# Altium schematic sheet CapBank_Supercaps.SchDoc
size A; SheetNumber: 4
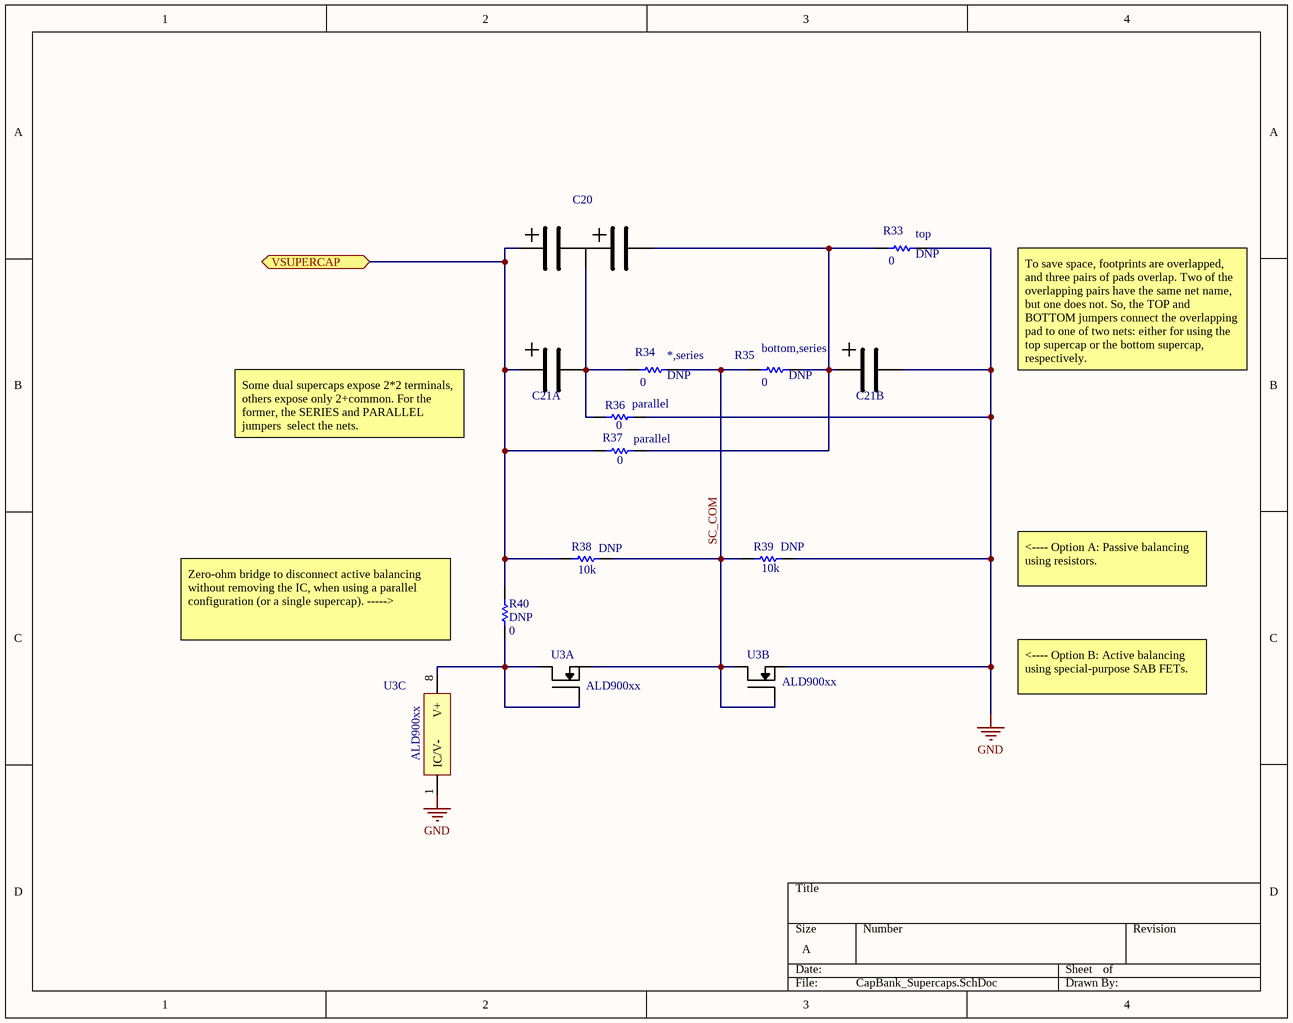
[diagram p0: CapBank_Supercaps.SchDoc]

## Parts
C20  SUPERCAP_DUAL_SERIES  [SUPERCAP_DMT]  (value not drawn)
C21  SUPERCAP_DUAL  [SUPERCAP_DMHA14R]  (value not drawn)  (parts A,B of 2)
R33  value 0  Note: DNP  Config: top  [0603]  (hidden comment: Res)
R34  value 0  Note: DNP  Config: *,series  [0603]  (hidden comment: Res)
R35  value 0  Note: DNP  Config: bottom,series  [0603]  (hidden comment: Res)
R36  value 0  Config: parallel  [0603]  (hidden comment: Res)
R37  value 0  Config: parallel  [0603]  (hidden comment: Res)
R38  value 10k  Note: DNP  [0603]  (hidden comment: Res)
R39  value 10k  Note: DNP  [0603]  (hidden comment: Res)
R40  value 0  Note: DNP  [0603]  (hidden comment: Res)
U3  ALD900xx  [SOIC8]  (parts A,B,C of 3)

## Ports
VSUPERCAP (bidir)

## Nets
GND: C21.4(N1) R33.2 R36.2 R39.2 U3.1(IC/V-) U3.5(SN2)
SC_COM: R34.2 R35.1 R38.2 R39.1 U3.4(SN1) U3.6(DN2) U3.7(GN2)
VSUPERCAP: C20.1(P) C21.1(P2) R37.1 R38.1 R40.1 ; port VSUPERCAP
NetC20_2: C20.2(BAL) C21.2(N2) R34.1 R36.1
NetC20_3: C20.3(N) C21.3(P1) R33.1 R35.2 R37.2
NetR40_2: R40.2 U3.2(GN1) U3.3(DN1) U3.8(V+)

## Notes on the sheet
- To save space, footprints are overlapped, and three pairs of pads overlap. Two of the overlapping pairs have the same net name, but one does not. So, the TOP and BOTTOM jumpers connect the overlapping pad to one of two nets: either for using the top supercap or the bottom supercap, respectively.
- Some dual supercaps expose 2*2 terminals, others expose only 2+common. For the former, the SERIES and PARALLEL jumpers  select the nets.
- Zero-ohm bridge to disconnect active balancing without removing the IC, when using a parallel configuration (or a single supercap). ----->
- <---- Option A: Passive balancing using resistors.
- <---- Option B: Active balancing using special-purpose SAB FETs.

## Library data of the parts
C20 = SUPERCAP_DUAL_SERIES: EDLC Supercap Dual with Balancing Terminal; Manufacturer: Murata Electronics; Manufacturer Part Number: DMT3N4R2U224M3DTA0; Note: OPT; Rating: 4.2/2.1V; Value: 220mF; Digi-Key Part Number: 490-13208-ND; Distributor: Mouser; Distributor Part Number: 81-DMT3N4R2U224M3DT0; Mouser Part Number: 81-DMT3N4R2U224M3DT0
C21 = SUPERCAP_DUAL: EDLC Supercap Dual; Manufacturer: Murata Electronics; Manufacturer Part Number: DMHA14R5V353M4ATA0; Note: OPT; Rating: 4.5/2.25V; Value: 35mF; Digi-Key Part Number: 490-17331-ND; Distributor: Mouser; Distributor Part Number: 81-DMHA14R5V353M4ATA; Mouser Part Number: 81-DMHA14R5V353M4ATA
R33-R37 R40 = Res: Chip Resistor (Surface Mount); Manufacturer: Yageo; Manufacturer Part Number: RC0603JR-070RL; Rating: *; Distributor: Digi-Key; Distributor Part Number: 311-0.0GRCT-ND
  R40: Digi-Key Part Number: *
R38 R39 = Res: Chip Resistor (Surface Mount); Manufacturer: Yageo; Manufacturer Part Number: RC0603FR-0710KL; Digi-Key Part Number: *; Rating: *; Distributor: Digi-Key; Distributor Part Number: 311-10.0KHRCT-ND
U3 = ALD9100xx: Manufacturer: Advanced Linear Devices Inc.; Manufacturer Part Number: ALD910021SAL; Distributor: Digikey; Distributor Part Number: 1014-1281-5-ND; Mouser Part Number: 585-ALD910021SAL; Digi-Key Part Number: 1014-1281-5-ND